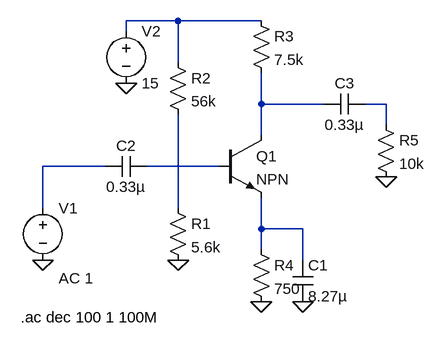
[diagram p0: schematic p1e3.asc]
p1e3.asc, the LTspice schematic file:
Version 4
SHEET 1 880 680
WIRE 64 -48 -16 -48
WIRE 192 -48 64 -48
WIRE -16 -32 -16 -48
WIRE 64 16 64 -48
WIRE 192 80 192 32
WIRE 288 80 192 80
WIRE 384 80 352 80
WIRE 384 112 384 80
WIRE 192 128 192 80
WIRE -48 176 -144 176
WIRE 128 176 16 176
WIRE -144 240 -144 176
WIRE 64 240 64 96
WIRE 192 272 192 224
WIRE 256 272 192 272
WIRE 192 304 192 272
WIRE 256 320 256 272
FLAG -144 320 0
FLAG 64 320 0
FLAG 192 384 0
FLAG 256 384 0
FLAG 384 192 0
FLAG -16 48 0
SYMBOL npn 128 128 R0
SYMATTR InstName Q1
SYMBOL cap 240 320 R0
SYMATTR InstName C1
SYMATTR Value 8.27µ
SYMBOL cap 16 160 R90
WINDOW 0 0 32 VBottom 2
WINDOW 3 32 32 VTop 2
SYMATTR InstName C2
SYMATTR Value 0.33µ
SYMBOL cap 352 64 R90
WINDOW 0 0 32 VBottom 2
WINDOW 3 32 32 VTop 2
SYMATTR InstName C3
SYMATTR Value 0.33µ
SYMBOL res 48 224 R0
SYMATTR InstName R1
SYMATTR Value 5.6k
SYMBOL res 48 0 R0
SYMATTR InstName R2
SYMATTR Value 56k
SYMBOL res 176 -64 R0
SYMATTR InstName R3
SYMATTR Value 7.5k
SYMBOL res 176 288 R0
SYMATTR InstName R4
SYMATTR Value 750
SYMBOL res 368 96 R0
SYMATTR InstName R5
SYMATTR Value 10k
SYMBOL voltage -144 224 R0
WINDOW 123 24 124 Left 2
WINDOW 39 0 0 Left 0
SYMATTR InstName V1
SYMATTR Value ""
SYMATTR Value2 AC 1
SYMBOL voltage -16 -48 R0
WINDOW 123 0 0 Left 0
WINDOW 39 0 0 Left 0
SYMATTR InstName V2
SYMATTR Value 15
TEXT -178 408 Left 2 !.ac dec 100 1 100M

The netlist it stands for:
* p1e3.asc
Q1 N002 N005 N007 0 NPN
C1 N007 0 8.27µ
C2 N005 N004 0.33µ
C3 N003 N002 0.33µ
R1 N006 0 5.6k
R2 N001 N006 56k
R3 N001 N002 7.5k
R4 N007 0 750
R5 N003 0 10k
V1 N004 0 AC 1
V2 N001 0 15
.model NPN NPN
.model PNP PNP
.lib standard.bjt
.ac dec 100 1 100M
.backanno
.end